# Altium schematic sheet 0033_DG2_debug_connecto.SchDoc
size 848 x 558 mm
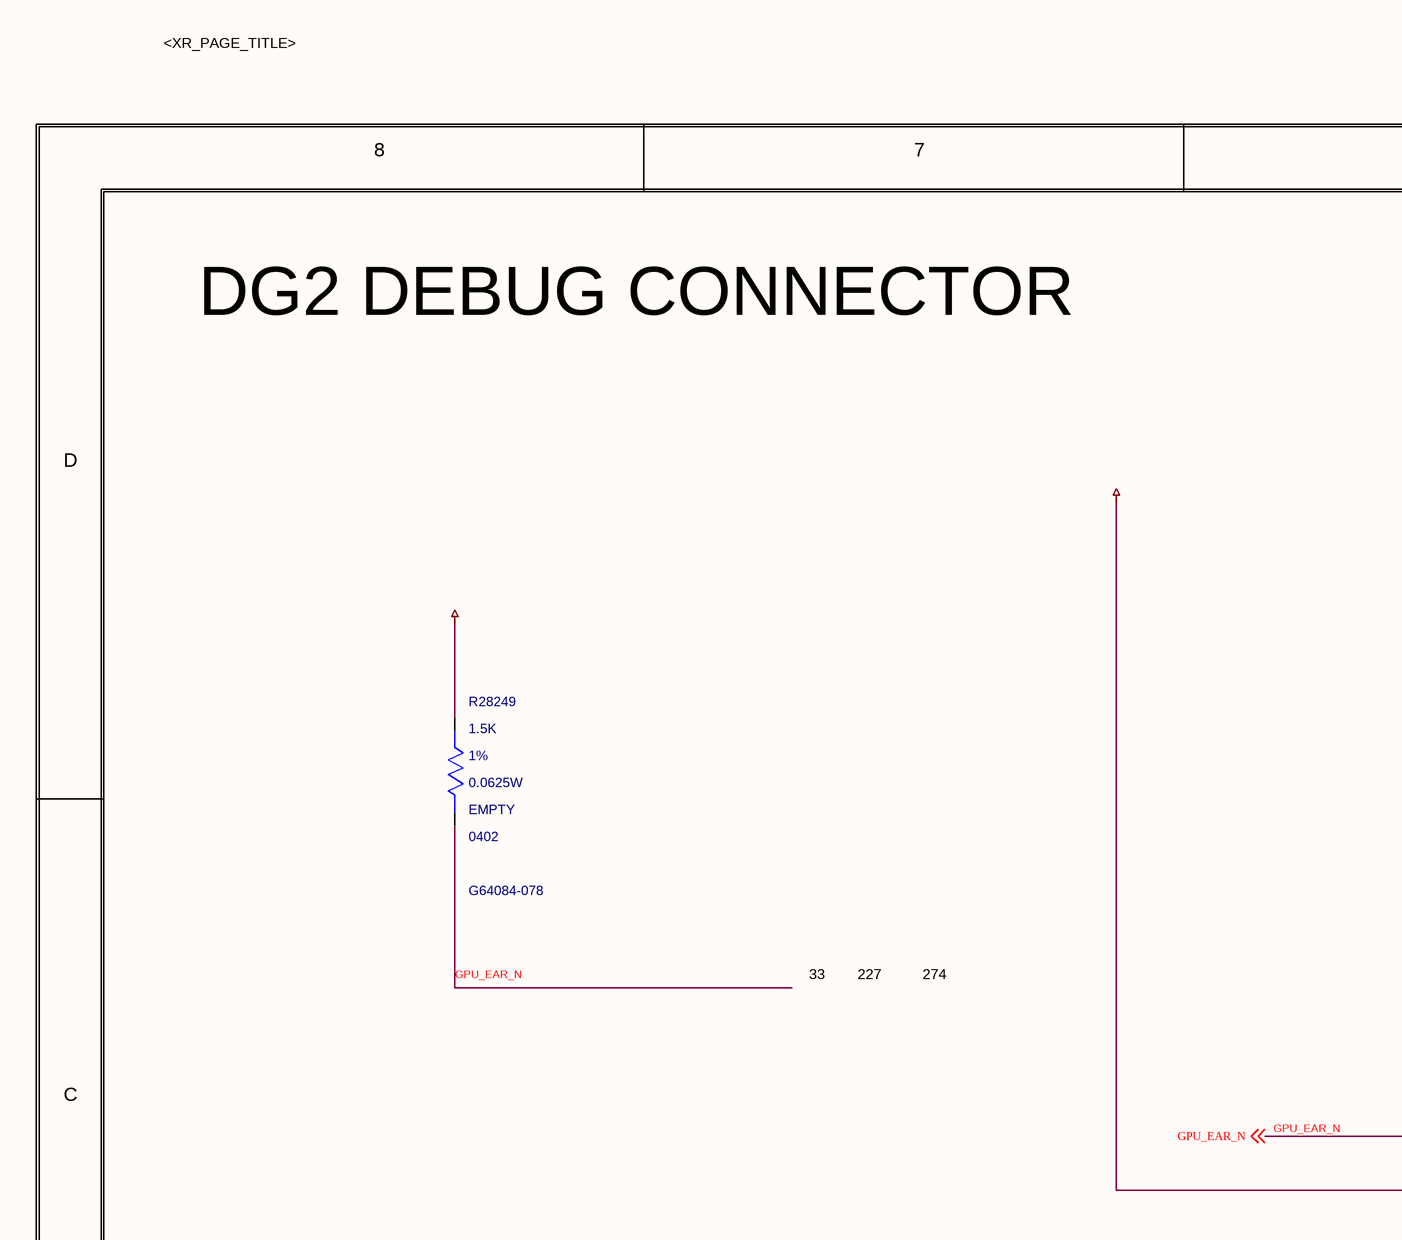
[diagram p0: 0033_DG2_debug_connecto.SchDoc, top left]
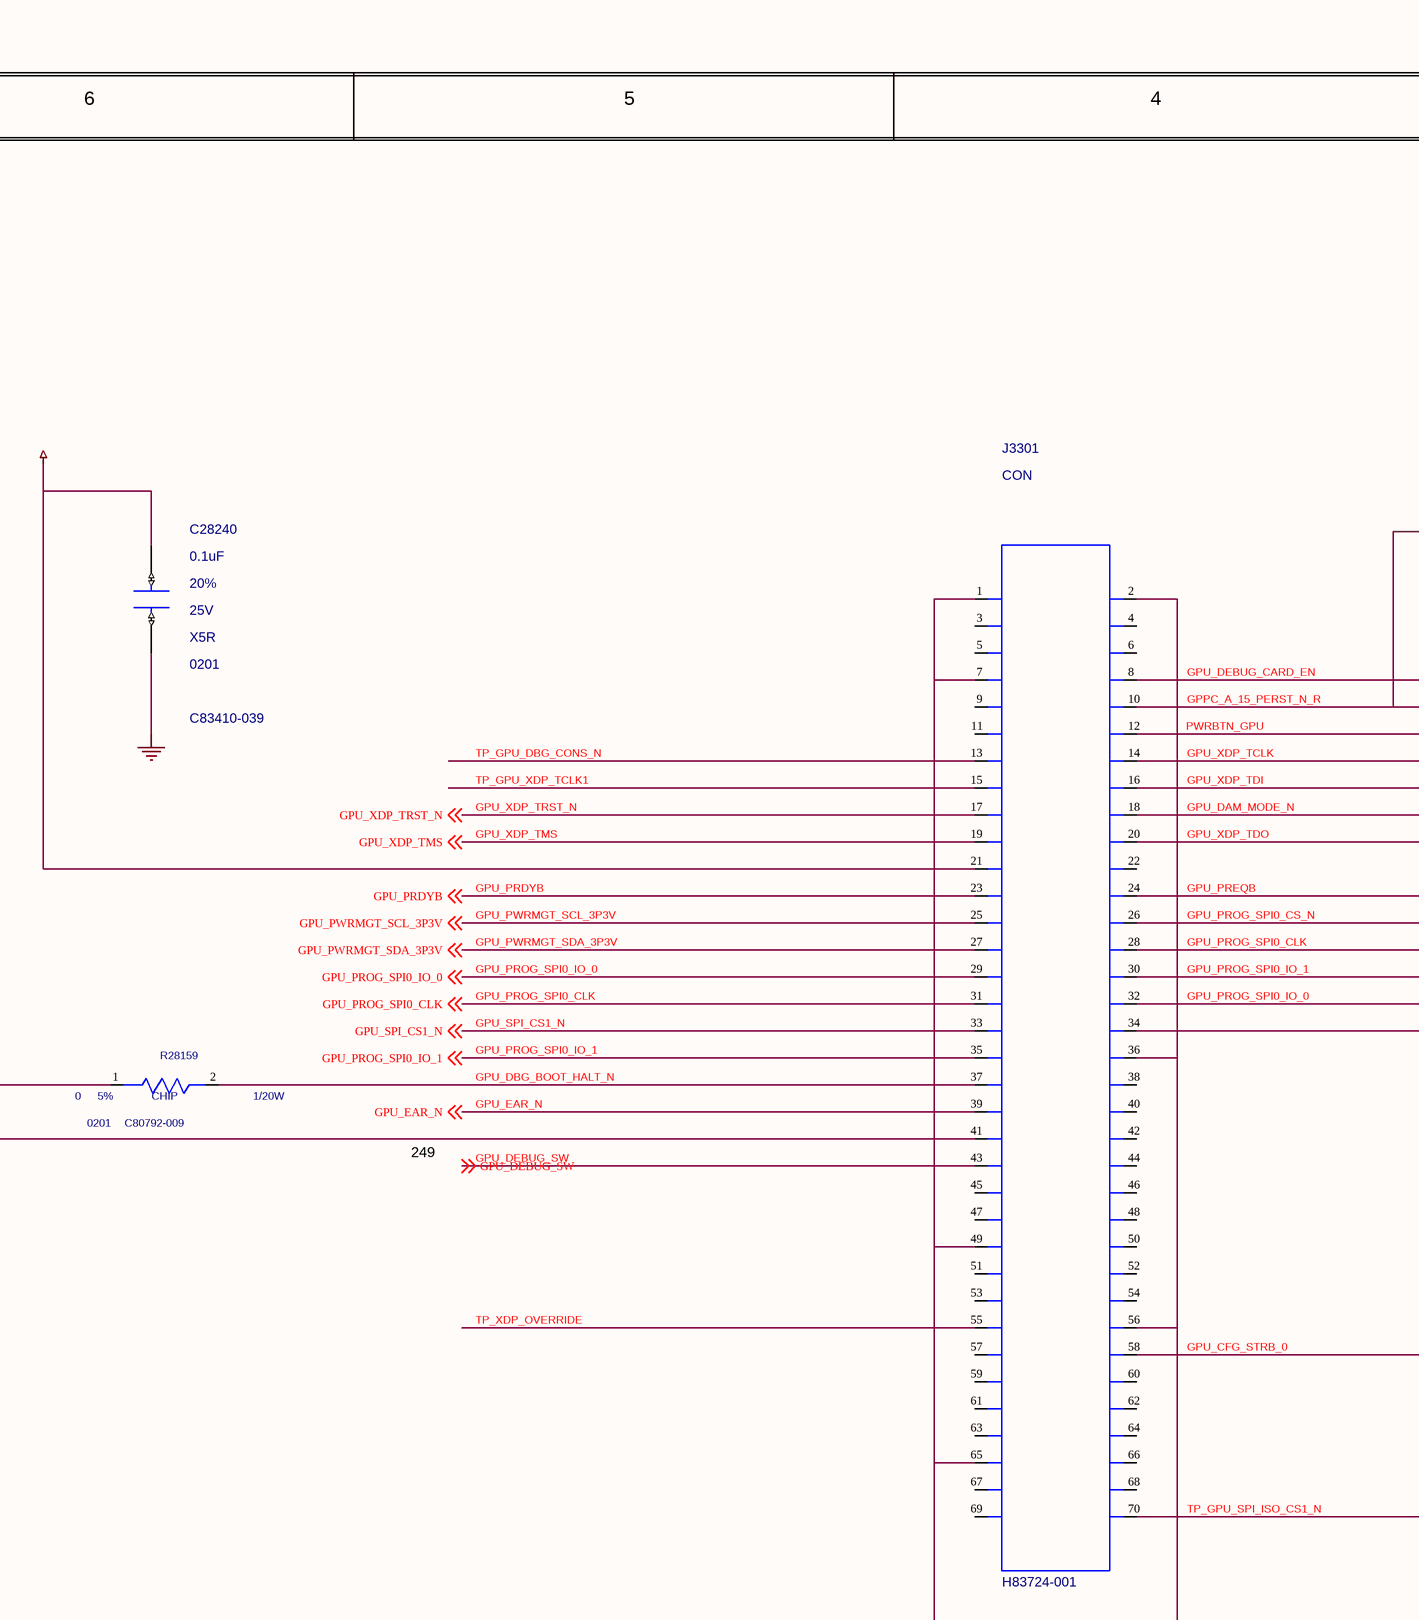
[diagram p1: 0033_DG2_debug_connecto.SchDoc, top middle]
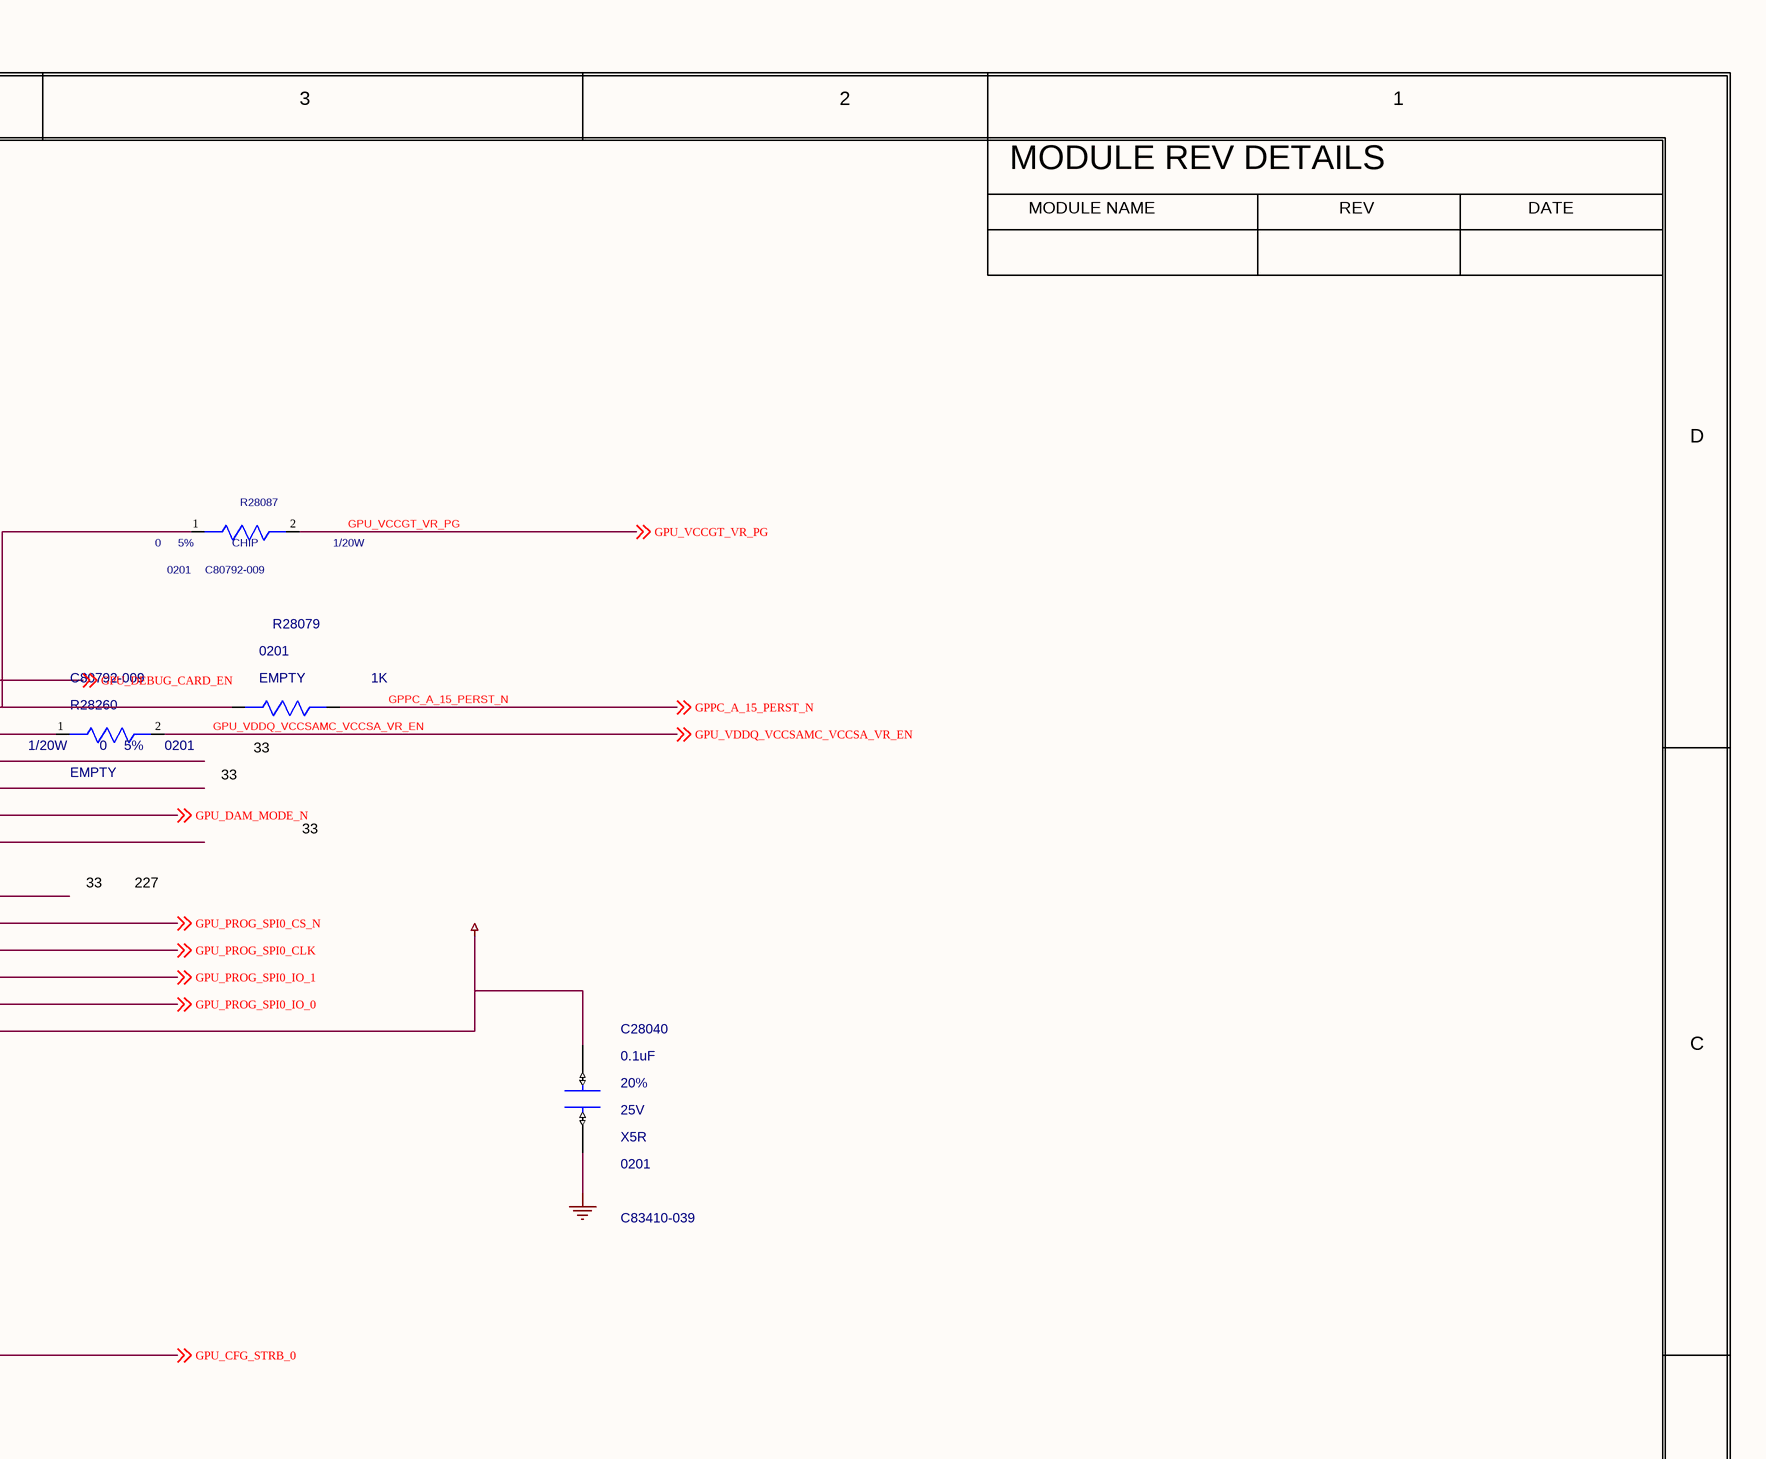
[diagram p2: 0033_DG2_debug_connecto.SchDoc, top right]
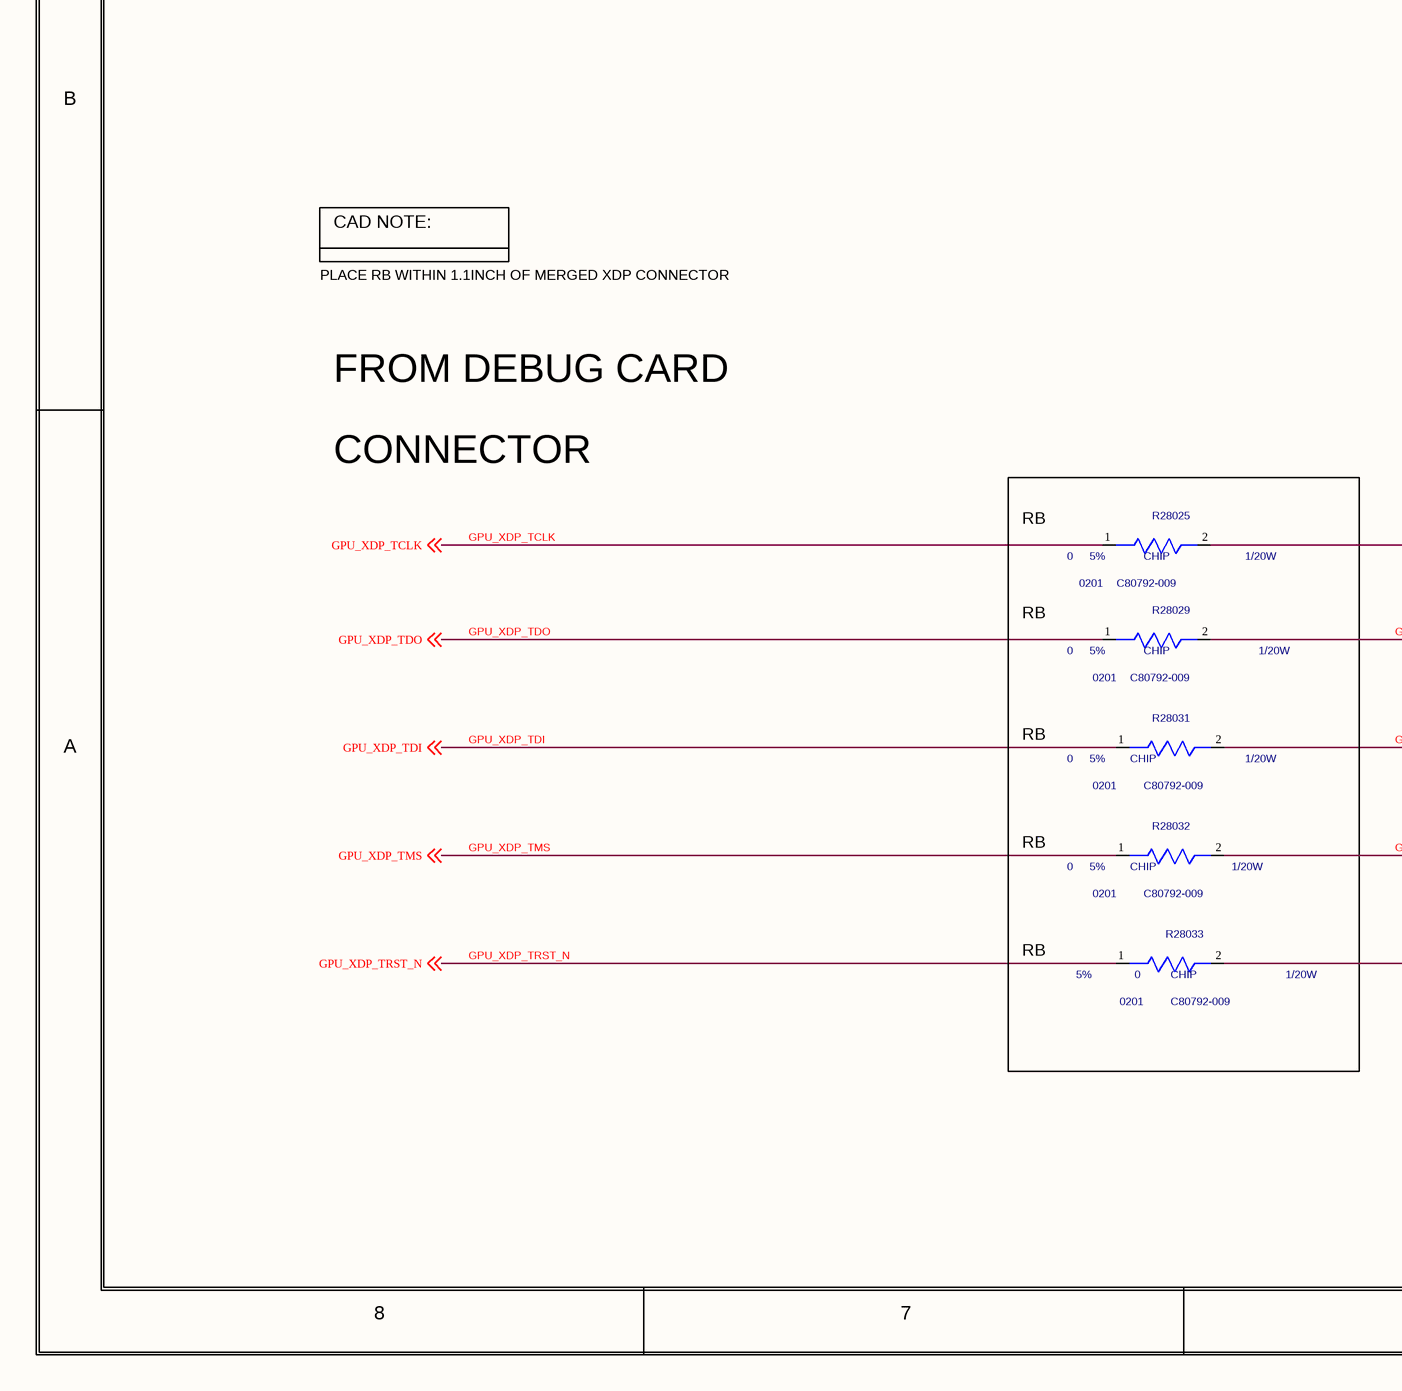
[diagram p3: 0033_DG2_debug_connecto.SchDoc, bottom left]
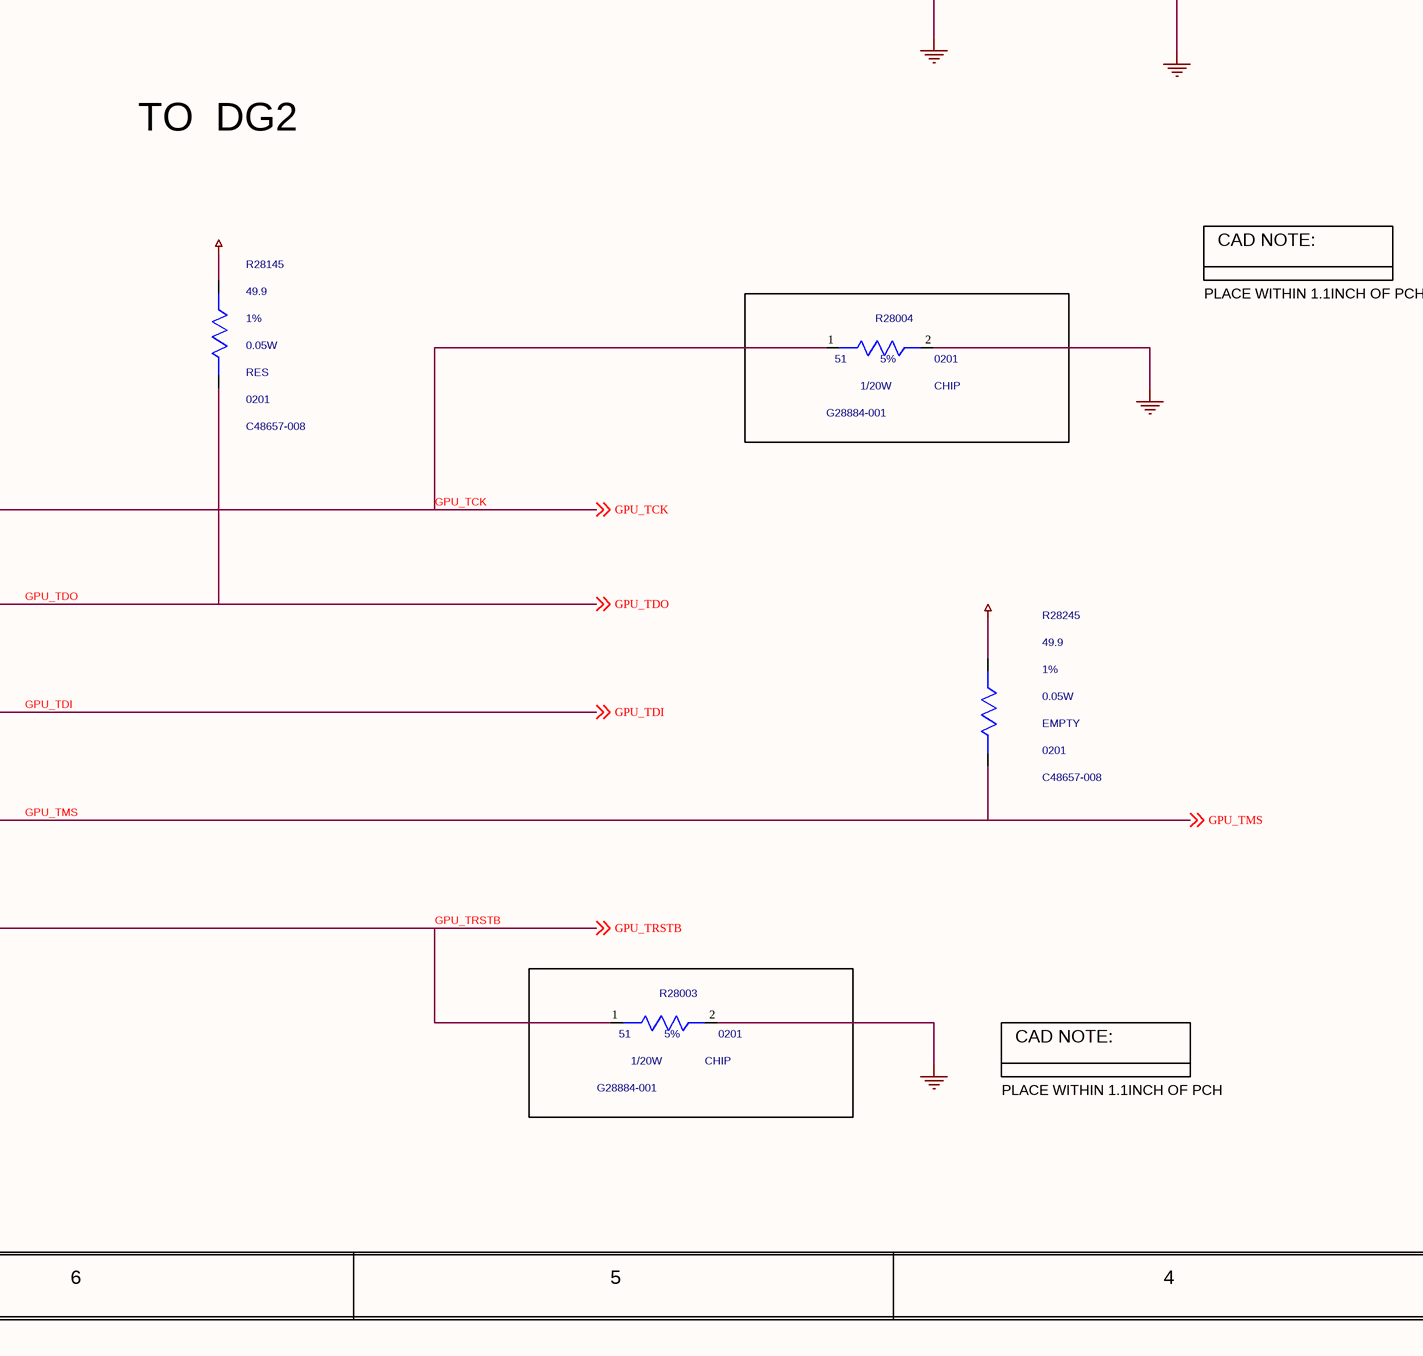
[diagram p4: 0033_DG2_debug_connecto.SchDoc, bottom middle]
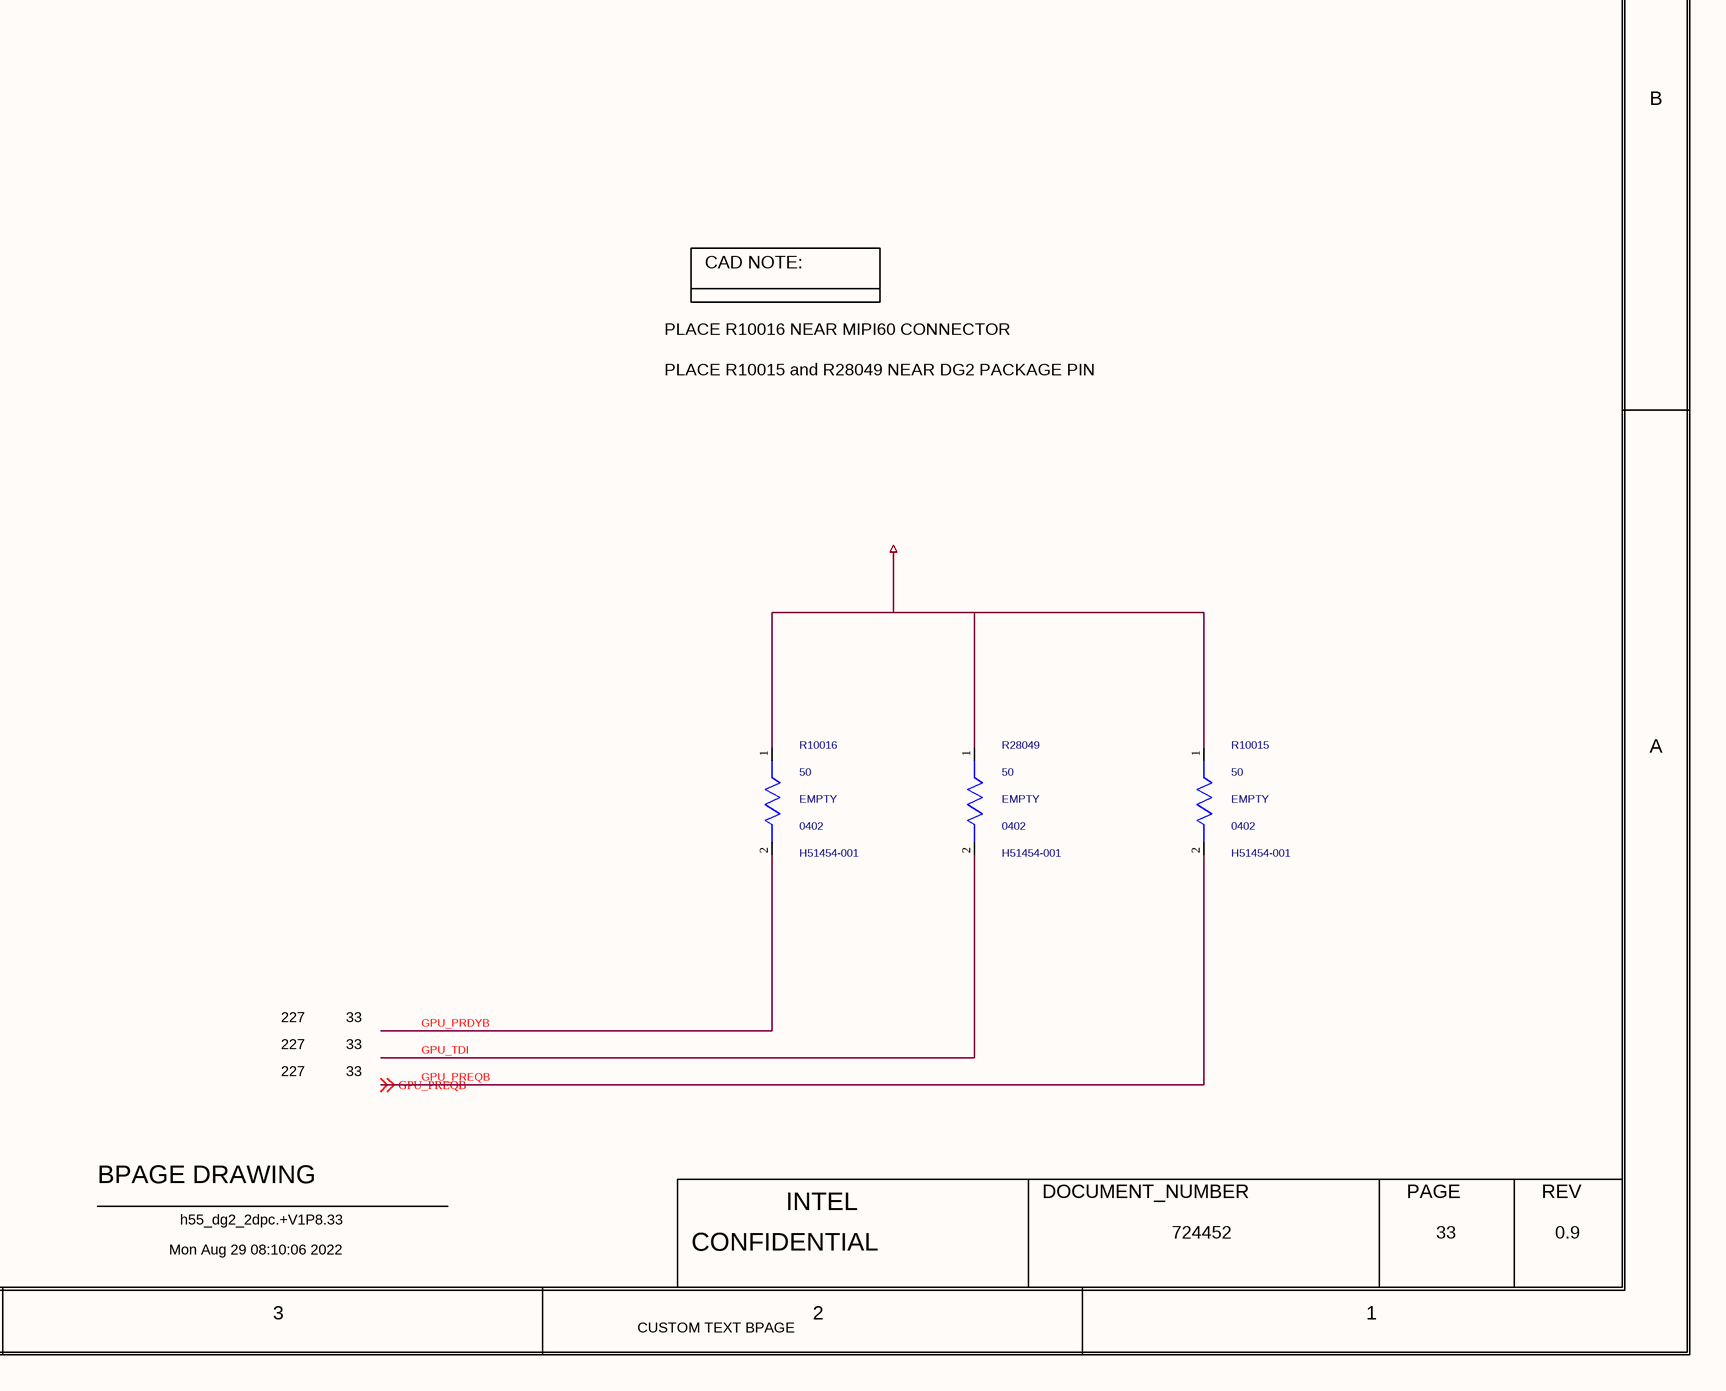
[diagram p5: 0033_DG2_debug_connecto.SchDoc, bottom right]

## Parts
C28040  0.1uF  MATERIAL: X5R  PACK_TYPE: 0201  PART_NUMBER: C83410-039  TOLERANCE: 20%  VOLTAGE: 25V  [TK0_SM0201_630X330_ME]
C28240  0.1uF  MATERIAL: X5R  PACK_TYPE: 0201  PART_NUMBER: C83410-039  TOLERANCE: 20%  VOLTAGE: 25V  [TK0_SM0201_630X330_ME]
J3301  MATERIAL: CON  PART_NUMBER: H83724-001  [CTK1_B2B_SJV_2X35_400_MA_VR]  (hidden comment: C_B2B_2X35)
R10015  50  MATERIAL: EMPTY  PACK_TYPE: 0402  PART_NUMBER: H51454-001  [SMR0402ID]
R10016  50  MATERIAL: EMPTY  PACK_TYPE: 0402  PART_NUMBER: H51454-001  [SMR0402ID]
R28003  51  MATERIAL: CHIP  PACK_TYPE: 0201  PART_NUMBER: G28884-001  TOLERANCE: 5%  WATTAGE: 1/20W  [SMR0201IA]
R28004  51  MATERIAL: CHIP  PACK_TYPE: 0201  PART_NUMBER: G28884-001  TOLERANCE: 5%  WATTAGE: 1/20W  [SMR0201IA]
R28025  0  MATERIAL: CHIP  PACK_TYPE: 0201  PART_NUMBER: C80792-009  TOLERANCE: 5%  WATTAGE: 1/20W  [SMR0201IA]
R28029  0  MATERIAL: CHIP  PACK_TYPE: 0201  PART_NUMBER: C80792-009  TOLERANCE: 5%  WATTAGE: 1/20W  [SMR0201IA]
R28031  0  MATERIAL: CHIP  PACK_TYPE: 0201  PART_NUMBER: C80792-009  TOLERANCE: 5%  WATTAGE: 1/20W  [SMR0201IA]
R28032  0  MATERIAL: CHIP  PACK_TYPE: 0201  PART_NUMBER: C80792-009  TOLERANCE: 5%  WATTAGE: 1/20W  [SMR0201IA]
R28033  0  MATERIAL: CHIP  PACK_TYPE: 0201  PART_NUMBER: C80792-009  TOLERANCE: 5%  WATTAGE: 1/20W  [SMR0201IA]
R28049  50  MATERIAL: EMPTY  PACK_TYPE: 0402  PART_NUMBER: H51454-001  [SMR0402ID]
R28079  1K  MATERIAL: EMPTY  PACK_TYPE: 0201  [TK0_SM0201_630X330_MC]
R28087  0  MATERIAL: CHIP  PACK_TYPE: 0201  PART_NUMBER: C80792-009  TOLERANCE: 5%  WATTAGE: 1/20W  [SMR0201IA]
R28145  49.9  MATERIAL: RES  PACK_TYPE: 0201  PART_NUMBER: C48657-008  TOLERANCE: 1%  WATTAGE: 0.05W  [CTK0_SM0201_650X350_MA]
R28159  0  MATERIAL: CHIP  PACK_TYPE: 0201  PART_NUMBER: C80792-009  TOLERANCE: 5%  WATTAGE: 1/20W  [SMR0201IA]
R28245  49.9  MATERIAL: EMPTY  PACK_TYPE: 0201  PART_NUMBER: C48657-008  TOLERANCE: 1%  WATTAGE: 0.05W  [CTK0_SM0201_650X350_MA]
R28249  1.5K  MATERIAL: EMPTY  PACK_TYPE: 0402  PART_NUMBER: G64084-078  TOLERANCE: 1%  WATTAGE: 0.0625W  [CTK2_SM0402_1050X550_MA]
R28260  0  MATERIAL: EMPTY  PACK_TYPE: 0201  PART_NUMBER: C80792-009  TOLERANCE: 5%  WATTAGE: 1/20W  [SMR0201IA]

## Nets
+V1P8S_GPU: C28240.1(A) J3301.21(IO21) J3301.41(IO41) R10015.1(A) R10016.1(A) R28049.1(A) R28145.1(A) R28245.1(A) R28249.1(A)
+VPROG_1P8A_CONN_GPU: C28040.1(A) J3301.34(IO34)
GND: C28040.2(B) C28240.2(B) J3301.1(IO1) J3301.2(IO2) J3301.7(IO7) J3301.36(IO36) J3301.49(IO49) J3301.56(IO56) J3301.65(IO65) R28003.2(B) R28004.2(B)
GPPC_A_15_PERST_N: R28079.2(B) ; off-sheet GPPC_A_15_PERST_N
GPPC_A_15_PERST_N_R: J3301.10(IO10) R28079.1(A) R28087.1(A)
GPU_CFG_STRB_0: J3301.58(IO58) ; off-sheet GPU_CFG_STRB_0
GPU_DAM_MODE_N: J3301.18(IO18) ; off-sheet GPU_DAM_MODE_N
GPU_DBG_BOOT_HALT_N: J3301.37(IO37) R28159.2(B)
GPU_DEBUG_CARD_EN: J3301.8(IO8) ; off-sheet GPU_DEBUG_CARD_EN
GPU_DEBUG_SW: J3301.43(IO43) ; off-sheet GPU_DEBUG_SW
GPU_EAR_N: J3301.39(IO39) R28159.1(A) R28249.2(B) ; off-sheet GPU_EAR_N
GPU_PRDYB: J3301.23(IO23) R10016.2(B) ; off-sheet GPU_PRDYB
GPU_PREQB: J3301.24(IO24) R10015.2(B) ; off-sheet GPU_PREQB
GPU_PROG_SPI0_CLK: J3301.28(IO28) J3301.31(IO31) ; off-sheet GPU_PROG_SPI0_CLK
GPU_PROG_SPI0_CS_N: J3301.26(IO26) ; off-sheet GPU_PROG_SPI0_CS_N
GPU_PROG_SPI0_IO_0: J3301.29(IO29) J3301.32(IO32) ; off-sheet GPU_PROG_SPI0_IO_0
GPU_PROG_SPI0_IO_1: J3301.30(IO30) J3301.35(IO35) ; off-sheet GPU_PROG_SPI0_IO_1
GPU_PWRMGT_SCL_3P3V: J3301.25(IO25) ; off-sheet GPU_PWRMGT_SCL_3P3V
GPU_PWRMGT_SDA_3P3V: J3301.27(IO27) ; off-sheet GPU_PWRMGT_SDA_3P3V
GPU_SPI_CS1_N: J3301.33(IO33) ; off-sheet GPU_SPI_CS1_N
GPU_TCK: R28004.1(A) R28025.2(B) ; off-sheet GPU_TCK
GPU_TDI: R28031.2(B) R28049.2(B) ; off-sheet GPU_TDI
GPU_TDO: R28029.2(B) R28145.2(B) ; off-sheet GPU_TDO
GPU_TMS: R28032.2(B) R28245.2(B) ; off-sheet GPU_TMS
GPU_TRSTB: R28003.1(A) R28033.2(B) ; off-sheet GPU_TRSTB
GPU_VCCGT_VR_PG: R28087.2(B) ; off-sheet GPU_VCCGT_VR_PG
GPU_VDDQ_VCCSAMC_VCCSA_VR_EN: R28260.2(B) ; off-sheet GPU_VDDQ_VCCSAMC_VCCSA_VR_EN
GPU_XDP_TCLK: J3301.14(IO14) R28025.1(A) ; off-sheet GPU_XDP_TCLK
GPU_XDP_TDI: J3301.16(IO16) R28031.1(A) ; off-sheet GPU_XDP_TDI
GPU_XDP_TDO: J3301.20(IO20) R28029.1(A) ; off-sheet GPU_XDP_TDO
GPU_XDP_TMS: J3301.19(IO19) R28032.1(A) ; off-sheet GPU_XDP_TMS
GPU_XDP_TRST_N: J3301.17(IO17) R28033.1(A) ; off-sheet GPU_XDP_TRST_N
PWRBTN_GPU: J3301.12(IO12) R28260.1(A)
TP_GPU_DBG_CONS_N: J3301.13(IO13)
TP_GPU_SPI_ISO_CS1_N: J3301.70(IO70)
TP_GPU_XDP_TCLK1: J3301.15(IO15)
TP_XDP_OVERRIDE: J3301.55(IO55)

Not connected (* = marked no-connect by the designer): J3301 3(IO3) 4(IO4) 5(IO5) 6(IO6) 9(IO9) 11(IO11) 22(IO22) 38(IO38) 40(IO40) 42(IO42) 44(IO44) 45(IO45) 46(IO46) 47(IO47) 48(IO48) 50(IO50) 51(IO51) 52(IO52) 53(IO53) 54(IO54) 57(IO57) 59(IO59) 60(IO60) 61(IO61) 62(IO62) 63(IO63) 64(IO64) 66(IO66) 67(IO67) 68(IO68) 69(IO69)

## Notes on the sheet
- <XR_PAGE_TITLE>
- 8
- 7
- 6
- 5
- 4
- 3
- 2
- 1
- MODULE REV DETAILS
- DG2 DEBUG CONNECTOR
- MODULE NAME
- REV
- DATE
- D
- 33
- (near R28079) 33
- 227
- 274
- C
- 249
- B
- TO  DG2
- CAD NOTE:
- PLACE RB WITHIN 1.1INCH OF MERGED XDP CONNECTOR
- PLACE WITHIN 1.1INCH OF PCH
- PLACE R10016 NEAR MIPI60 CONNECTOR
- FROM DEBUG CARD
- PLACE R10015 and R28049 NEAR DG2 PACKAGE PIN
- CONNECTOR
- RB
- A
- BPAGE DRAWING
- INTEL
- DOCUMENT_NUMBER
- PAGE
- Mon Aug 29 08:10:06 2022
- h55_dg2_2dpc.+V1P8.33
- CONFIDENTIAL
- 724452
- 0.9
- CUSTOM TEXT BPAGE

## Library data of the parts
C28040 = CAP_2: CDS_PHYS_PART_NAME: CAP_2_0201-C83410-039,X5R,0.1UF,25V,20%,TK0,GENERIC; BOM_USE: STUFF; CDS_LMAN_SYM_OUTLINE: -50,50,50,-50; FP_TECH: TK0; IP: GENERIC; ROOM: NONE; OriginalSymbolOrigin: (-50,25); XY: (9425,4925); VER: 1; ROT: 0; PHYS_PAGE: 33; LOCATION: C28040; DRAWING: @RVP1_ADL_SB_ADP_S_DDR5_SODIMM_2DPC_LIB.H55_DG2_2DPC(SCH_1):PAGE384; CDS_LIB: discrete_2; VARIANT: ?; PCB Footprint: TK0_SM0201_630X330_ME; CHIPS_PART_NAME: CAP_2; CDS_PART_NAME: CAP_2_0201-C83410-039,X5R,0.1UF,25V,20%,TK0,GENERIC; CDS_LOCATION: C28040
C28240 = CAP_2: CDS_PHYS_PART_NAME: CAP_2_0201-C83410-039,X5R,0.1UF,25V,20%,TK0,GENERIC; BOM_USE: STUFF; CDS_LMAN_SYM_OUTLINE: -50,50,50,-50; FP_TECH: TK0; IP: GENERIC; ROOM: NONE; OriginalSymbolOrigin: (-50,25); XY: (6050,5850); VER: 1; ROT: 0; PHYS_PAGE: 33; LOCATION: C28240; DRAWING: @RVP1_ADL_SB_ADP_S_DDR5_SODIMM_2DPC_LIB.H55_DG2_2DPC(SCH_1):PAGE384; CDS_LIB: discrete_2; VARIANT: ?; PCB Footprint: TK0_SM0201_630X330_ME; CHIPS_PART_NAME: CAP_2; CDS_PART_NAME: CAP_2_0201-C83410-039,X5R,0.1UF,25V,20%,TK0,GENERIC; CDS_LOCATION: C28240
J3301 = C_B2B_2X35: CDS_PHYS_PART_NAME: C_B2B_2X35_SM-H83724-001,CON,B2B_2X35,TK1,GENERIC; CDS_LMAN_SYM_OUTLINE: -100,950,100,-950; FP_TECH: TK1; IP: GENERIC; PACK_TYPE: SM; ROOM: NONE; OriginalSymbolOrigin: (-125,950); XY: (7725,5000); VER: 1; ROT: 0; PHYS_PAGE: 33; LOCATION: J3301; DRAWING: @RVP1_ADL_SB_ADP_S_DDR5_SODIMM_2DPC_LIB.H55_DG2_2DPC(SCH_1):PAGE384; CDS_LIB: local; VARIANT: ?; PCB Footprint: CTK1_B2B_SJV_2X35_400_MA_VR; SEC_TYPE: SM; CHIPS_PART_NAME: C_B2B_2X35; CDS_PART_NAME: C_B2B_2X35_SM-H83724-001,CON,B2B_2X35,TK1,GENERIC; CDS_LOCATION: J3301
R10015 = RES: CDS_PHYS_PART_NAME: RES_0402-H51454-001,EMPTY,50,0.1%,1/20W,LPDB,GENERIC; TOLERANCE: 0.1%; WATTAGE: 1/20W; OriginalSymbolOrigin: (-25,75); XY: (10650,2600); VER: 2; ROT: 0; PHYS_PAGE: 33; LOCATION: R10015; DRAWING: @RVP1_ADL_SB_ADP_S_DDR5_SODIMM_2DPC_LIB.H55_DG2_2DPC(SCH_1):PAGE384; CDS_LIB: discrete; PCB Footprint: SMR0402ID; SEC_TYPE: 0402; CHIPS_PART_NAME: RES; CDS_PART_NAME: RES_0402-H51454-001,EMPTY,50,0.1%,1/20W,LPDB,GENERIC; CDS_LOCATION: R10015
R10016 = RES: CDS_PHYS_PART_NAME: RES_0402-H51454-001,EMPTY,50,0.1%,1/20W,LPDB,GENERIC; TOLERANCE: 0.1%; WATTAGE: 1/20W; OriginalSymbolOrigin: (-25,75); XY: (9850,2600); VER: 2; ROT: 0; PHYS_PAGE: 33; LOCATION: R10016; DRAWING: @RVP1_ADL_SB_ADP_S_DDR5_SODIMM_2DPC_LIB.H55_DG2_2DPC(SCH_1):PAGE384; CDS_LIB: discrete; PCB Footprint: SMR0402ID; SEC_TYPE: 0402; CHIPS_PART_NAME: RES; CDS_PART_NAME: RES_0402-H51454-001,EMPTY,50,0.1%,1/20W,LPDB,GENERIC; CDS_LOCATION: R10016
R28003 = RES#1: CHIPS_PART_NAME: RES; CDS_PHYS_PART_NAME: RES_0201-G28884-001,CHIP,51,5%,1/20W,LPDB,GENERIC; OriginalSymbolOrigin: (-75,25); XY: (7000,2125); VER: 1; SUB_ROOM_2: PLACEHOLDER; SUB_ROOM_1: AP_SOC; SUB_ROOM: PUPD; ROT: 0; PHYS_PAGE: 33; LOCATION: R28003; DRAWING: @RVP1_ADL_SB_ADP_S_DDR5_SODIMM_2DPC_LIB.H55_DG2_2DPC(SCH_1):PAGE384; CDS_LIB: discrete; PCB Footprint: SMR0201IA; SEC_TYPE: 0201; CDS_PART_NAME: RES_0201-G28884-001,CHIP,51,5%,1/20W,LPDB,GENERIC; CDS_LOCATION: R28003
R28004 = RES#1: CHIPS_PART_NAME: RES; CDS_PHYS_PART_NAME: RES_0201-G28884-001,CHIP,51,5%,1/20W,LPDB,GENERIC; OriginalSymbolOrigin: (-75,25); XY: (7400,3375); VER: 1; SUB_ROOM_2: PLACEHOLDER; SUB_ROOM_1: AP_SOC; SUB_ROOM: PUPD; ROT: 0; PHYS_PAGE: 33; LOCATION: R28004; DRAWING: @RVP1_ADL_SB_ADP_S_DDR5_SODIMM_2DPC_LIB.H55_DG2_2DPC(SCH_1):PAGE384; CDS_LIB: discrete; PCB Footprint: SMR0201IA; SEC_TYPE: 0201; CDS_PART_NAME: RES_0201-G28884-001,CHIP,51,5%,1/20W,LPDB,GENERIC; CDS_LOCATION: R28004
R28025 = RES#1: CHIPS_PART_NAME: RES; CDS_PHYS_PART_NAME: RES_0201-C80792-009,CHIP,0,5%,1/20W,LPDB,GENERIC; OriginalSymbolOrigin: (-75,25); XY: (5375,3075); VER: 1; PHYS_PAGE: 33; LOCATION: R28025; IP: GENERIC; FP_TECH: LPDB; DRAWING: @RVP1_ADL_SB_ADP_S_DDR5_SODIMM_2DPC_LIB.H55_DG2_2DPC(SCH_1):PAGE384; CDS_LIB: discrete; PCB Footprint: SMR0201IA; SEC_TYPE: 0201; ROT: 0; CDS_PART_NAME: RES_0201-C80792-009,CHIP,0,5%,1/20W,LPDB,GENERIC; CDS_LOCATION: R28025
R28029 = RES#1: CHIPS_PART_NAME: RES; CDS_PHYS_PART_NAME: RES_0201-C80792-009,CHIP,0,5%,1/20W,LPDB,GENERIC; OriginalSymbolOrigin: (-75,25); XY: (5375,2900); VER: 1; PHYS_PAGE: 33; LOCATION: R28029; IP: GENERIC; FP_TECH: LPDB; DRAWING: @RVP1_ADL_SB_ADP_S_DDR5_SODIMM_2DPC_LIB.H55_DG2_2DPC(SCH_1):PAGE384; CDS_LIB: discrete; PCB Footprint: SMR0201IA; SEC_TYPE: 0201; ROT: 0; CDS_PART_NAME: RES_0201-C80792-009,CHIP,0,5%,1/20W,LPDB,GENERIC; CDS_LOCATION: R28029
R28031 = RES#1: CHIPS_PART_NAME: RES; CDS_PHYS_PART_NAME: RES_0201-C80792-009,CHIP,0,5%,1/20W,LPDB,GENERIC; OriginalSymbolOrigin: (-75,25); XY: (5400,2700); VER: 1; PHYS_PAGE: 33; LOCATION: R28031; IP: GENERIC; FP_TECH: LPDB; DRAWING: @RVP1_ADL_SB_ADP_S_DDR5_SODIMM_2DPC_LIB.H55_DG2_2DPC(SCH_1):PAGE384; CDS_LIB: discrete; PCB Footprint: SMR0201IA; SEC_TYPE: 0201; ROT: 0; CDS_PART_NAME: RES_0201-C80792-009,CHIP,0,5%,1/20W,LPDB,GENERIC; CDS_LOCATION: R28031
R28032 = RES#1: CHIPS_PART_NAME: RES; CDS_PHYS_PART_NAME: RES_0201-C80792-009,CHIP,0,5%,1/20W,LPDB,GENERIC; OriginalSymbolOrigin: (-75,25); XY: (5400,2500); VER: 1; PHYS_PAGE: 33; LOCATION: R28032; IP: GENERIC; FP_TECH: LPDB; DRAWING: @RVP1_ADL_SB_ADP_S_DDR5_SODIMM_2DPC_LIB.H55_DG2_2DPC(SCH_1):PAGE384; CDS_LIB: discrete; PCB Footprint: SMR0201IA; SEC_TYPE: 0201; ROT: 0; CDS_PART_NAME: RES_0201-C80792-009,CHIP,0,5%,1/20W,LPDB,GENERIC; CDS_LOCATION: R28032
R28033 = RES#1: CHIPS_PART_NAME: RES; CDS_PHYS_PART_NAME: RES_0201-C80792-009,CHIP,0,5%,1/20W,LPDB,GENERIC; OriginalSymbolOrigin: (-75,25); XY: (5400,2300); VER: 1; PHYS_PAGE: 33; LOCATION: R28033; IP: GENERIC; FP_TECH: LPDB; DRAWING: @RVP1_ADL_SB_ADP_S_DDR5_SODIMM_2DPC_LIB.H55_DG2_2DPC(SCH_1):PAGE384; CDS_LIB: discrete; PCB Footprint: SMR0201IA; SEC_TYPE: 0201; ROT: 0; CDS_PART_NAME: RES_0201-C80792-009,CHIP,0,5%,1/20W,LPDB,GENERIC; CDS_LOCATION: R28033
R28049 = RES: CDS_PHYS_PART_NAME: RES_0402-H51454-001,EMPTY,50,0.1%,1/20W,LPDB,GENERIC; TOLERANCE: 0.1%; WATTAGE: 1/20W; OriginalSymbolOrigin: (-25,75); XY: (10225,2600); VER: 2; ROT: 0; PHYS_PAGE: 33; LOCATION: R28049; DRAWING: @RVP1_ADL_SB_ADP_S_DDR5_SODIMM_2DPC_LIB.H55_DG2_2DPC(SCH_1):PAGE384; CDS_LIB: discrete; PCB Footprint: SMR0402ID; SEC_TYPE: 0402; CHIPS_PART_NAME: RES; CDS_PART_NAME: RES_0402-H51454-001,EMPTY,50,0.1%,1/20W,LPDB,GENERIC; CDS_LOCATION: R28049
R28079 = RES_2#1: PART_NUMBER: C48657-010; CHIPS_PART_NAME: RES_2; CDS_PHYS_PART_NAME: RES_2_0201-C48657-010,EMPTY,1K,1%,0.05W,TK0,GENERIC; BOM_USE: STUFF; CDS_LMAN_SYM_OUTLINE: -50,50,50,-50; FP_TECH: TK0; IP: GENERIC; ROOM: NONE; TOLERANCE: 1%; WATTAGE: 0.05W; OriginalSymbolOrigin: (-75,25); XY: (8875,5650); VER: 1; ROT: 0; PHYS_PAGE: 33; LOCATION: R28079; DRAWING: @RVP1_ADL_SB_ADP_S_DDR5_SODIMM_2DPC_LIB.H55_DG2_2DPC(SCH_1):PAGE384; CDS_LIB: discrete_2; VARIANT: ?; PCB Footprint: TK0_SM0201_630X330_MC; CDS_PART_NAME: RES_2_0201-C48657-010,EMPTY,1K,1%,0.05W,TK0,GENERIC; CDS_LOCATION: R28079
R28087 = RES#1: CHIPS_PART_NAME: RES; CDS_PHYS_PART_NAME: RES_0201-C80792-009,CHIP,0,5%,1/20W,LPDB,GENERIC; OriginalSymbolOrigin: (-75,25); XY: (8800,5975); VER: 1; PHYS_PAGE: 33; LOCATION: R28087; IP: GENERIC; FP_TECH: LPDB; DRAWING: @RVP1_ADL_SB_ADP_S_DDR5_SODIMM_2DPC_LIB.H55_DG2_2DPC(SCH_1):PAGE384; CDS_LIB: discrete; PCB Footprint: SMR0201IA; ROT: 0; CDS_PART_NAME: RES_0201-C80792-009,CHIP,0,5%,1/20W,LPDB,GENERIC; CDS_LOCATION: R28087
R28145 = C_RES: CDS_PHYS_PART_NAME: C_RES_0201-C48657-008,RES,49.9,1%,0.05W,TK0,GENERIC; CDS_LMAN_SYM_OUTLINE: -50,50,50,-50; FP_TECH: TK0; IP: GENERIC; ROOM: NONE; OriginalSymbolOrigin: (-25,75); XY: (6175,3400); VER: 2; ROT: 0; PHYS_PAGE: 33; LOCATION: R28145; DRAWING: @RVP1_ADL_SB_ADP_S_DDR5_SODIMM_2DPC_LIB.H55_DG2_2DPC(SCH_1):PAGE384; CDS_LIB: c_discrete; VARIANT: ?; PCB Footprint: CTK0_SM0201_650X350_MA; SEC_TYPE: 0201; CHIPS_PART_NAME: C_RES; CDS_PART_NAME: C_RES_0201-C48657-008,RES,49.9,1%,0.05W,TK0,GENERIC; CDS_LOCATION: R28145
R28159 = RES#1: CHIPS_PART_NAME: RES; CDS_PHYS_PART_NAME: RES_0201-C80792-009,CHIP,0,5%,1/20W,LPDB,GENERIC; OriginalSymbolOrigin: (-75,25); XY: (6075,4950); VER: 1; PHYS_PAGE: 33; LOCATION: R28159; IP: GENERIC; FP_TECH: LPDB; DRAWING: @RVP1_ADL_SB_ADP_S_DDR5_SODIMM_2DPC_LIB.H55_DG2_2DPC(SCH_1):PAGE384; CDS_LIB: discrete; PCB Footprint: SMR0201IA; ROT: 0; CDS_PART_NAME: RES_0201-C80792-009,CHIP,0,5%,1/20W,LPDB,GENERIC; CDS_LOCATION: R28159
R28245 = C_RES: CDS_PHYS_PART_NAME: C_RES_0201-C48657-008,EMPTY,49.9,1%,0.05W,TK0,GENERIC; CDS_LMAN_SYM_OUTLINE: -50,50,50,-50; FP_TECH: TK0; IP: GENERIC; ROOM: NONE; OriginalSymbolOrigin: (-25,75); XY: (7600,2700); VER: 2; ROT: 0; PHYS_PAGE: 33; LOCATION: R28245; DRAWING: @RVP1_ADL_SB_ADP_S_DDR5_SODIMM_2DPC_LIB.H55_DG2_2DPC(SCH_1):PAGE384; CDS_LIB: c_discrete; VARIANT: ?; PCB Footprint: CTK0_SM0201_650X350_MA; SEC_TYPE: 0201; CHIPS_PART_NAME: C_RES; CDS_PART_NAME: C_RES_0201-C48657-008,EMPTY,49.9,1%,0.05W,TK0,GENERIC; CDS_LOCATION: R28245
R28249 = C_RES: CDS_PHYS_PART_NAME: C_RES_0402-G64084-078,EMPTY,1.5K,1%,0.0625W,TK2,GENERIC; CDS_LMAN_SYM_OUTLINE: -50,50,50,-50; FP_TECH: TK2; IP: GENERIC; ROOM: NONE; OriginalSymbolOrigin: (-25,75); XY: (4075,5625); VER: 2; ROT: 0; PHYS_PAGE: 33; LOCATION: R28249; DRAWING: @RVP1_ADL_SB_ADP_S_DDR5_SODIMM_2DPC_LIB.H55_DG2_2DPC(SCH_1):PAGE384; CDS_LIB: c_discrete; VARIANT: ?; PCB Footprint: CTK2_SM0402_1050X550_MA; CHIPS_PART_NAME: C_RES; CDS_PART_NAME: C_RES_0402-G64084-078,EMPTY,1.5K,1%,0.0625W,TK2,GENERIC; CDS_LOCATION: R28249
R28260 = RES#1: CHIPS_PART_NAME: RES; CDS_PHYS_PART_NAME: RES_0201-C80792-009,EMPTY,0,5%,1/20W,LPDB,GENERIC; OriginalSymbolOrigin: (-75,25); XY: (8550,5600); VER: 1; PHYS_PAGE: 33; LOCATION: R28260; IP: GENERIC; FP_TECH: LPDB; DRAWING: @RVP1_ADL_SB_ADP_S_DDR5_SODIMM_2DPC_LIB.H55_DG2_2DPC(SCH_1):PAGE384; CDS_LIB: discrete; PCB Footprint: SMR0201IA; ROT: 0; CDS_PART_NAME: RES_0201-C80792-009,EMPTY,0,5%,1/20W,LPDB,GENERIC; CDS_LOCATION: R28260